# Altium schematic sheet Sheet1.SchDoc
size A4
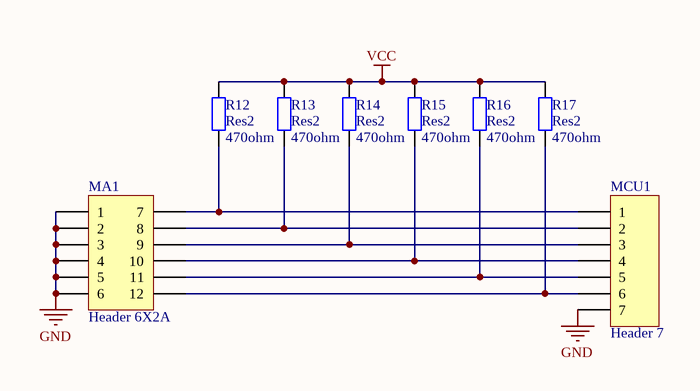
[diagram p0: Sheet1.SchDoc]

## Parts
MA1  Header 6X2A  [HDR2X6_CEN]
MCU1  Header 7  [HDR1X7]
R12  Res2  value 470ohm  [AXIAL-0.4]
R13  Res2  value 470ohm  [AXIAL-0.4]
R14  Res2  value 470ohm  [AXIAL-0.4]
R15  Res2  value 470ohm  [AXIAL-0.4]
R16  Res2  value 470ohm  [AXIAL-0.4]
R17  Res2  value 470ohm  [AXIAL-0.4]

## Nets
GND: MA1.1 MA1.2 MA1.3 MA1.4 MA1.5 MA1.6 MCU1.7
VCC: R12.2 R13.2 R14.2 R15.2 R16.2 R17.2
NetMA1_7: MA1.7 MCU1.1 R12.1
NetMA1_8: MA1.8 MCU1.2 R13.1
NetMA1_9: MA1.9 MCU1.3 R14.1
NetMA1_10: MA1.10 MCU1.4 R15.1
NetMA1_11: MA1.11 MCU1.5 R16.1
NetMA1_12: MA1.12 MCU1.6 R17.1

## Library data of the parts
MA1 = Header 6X2A: Header, 6-Pin, Dual row; LatestRevisionDate: 17-Jul-2002; LatestRevisionNote: Re-released for DXP Platform.; Publisher: Altium Limited
MCU1 = Header 7: Header, 7-Pin; LatestRevisionDate: 17-Jul-2002; LatestRevisionNote: Re-released for DXP Platform.; Publisher: Altium Limited
R12-R17 = Res2: Resistor; Published: 8-Jun-2000; LatestRevisionDate: 17-Jul-2002; LatestRevisionNote: Re-released for DXP Platform.; PackageReference: AXIAL-0.4; Publisher: Altium Limited